# EAGLE design arcade-X (EAGLE 7.6.0)
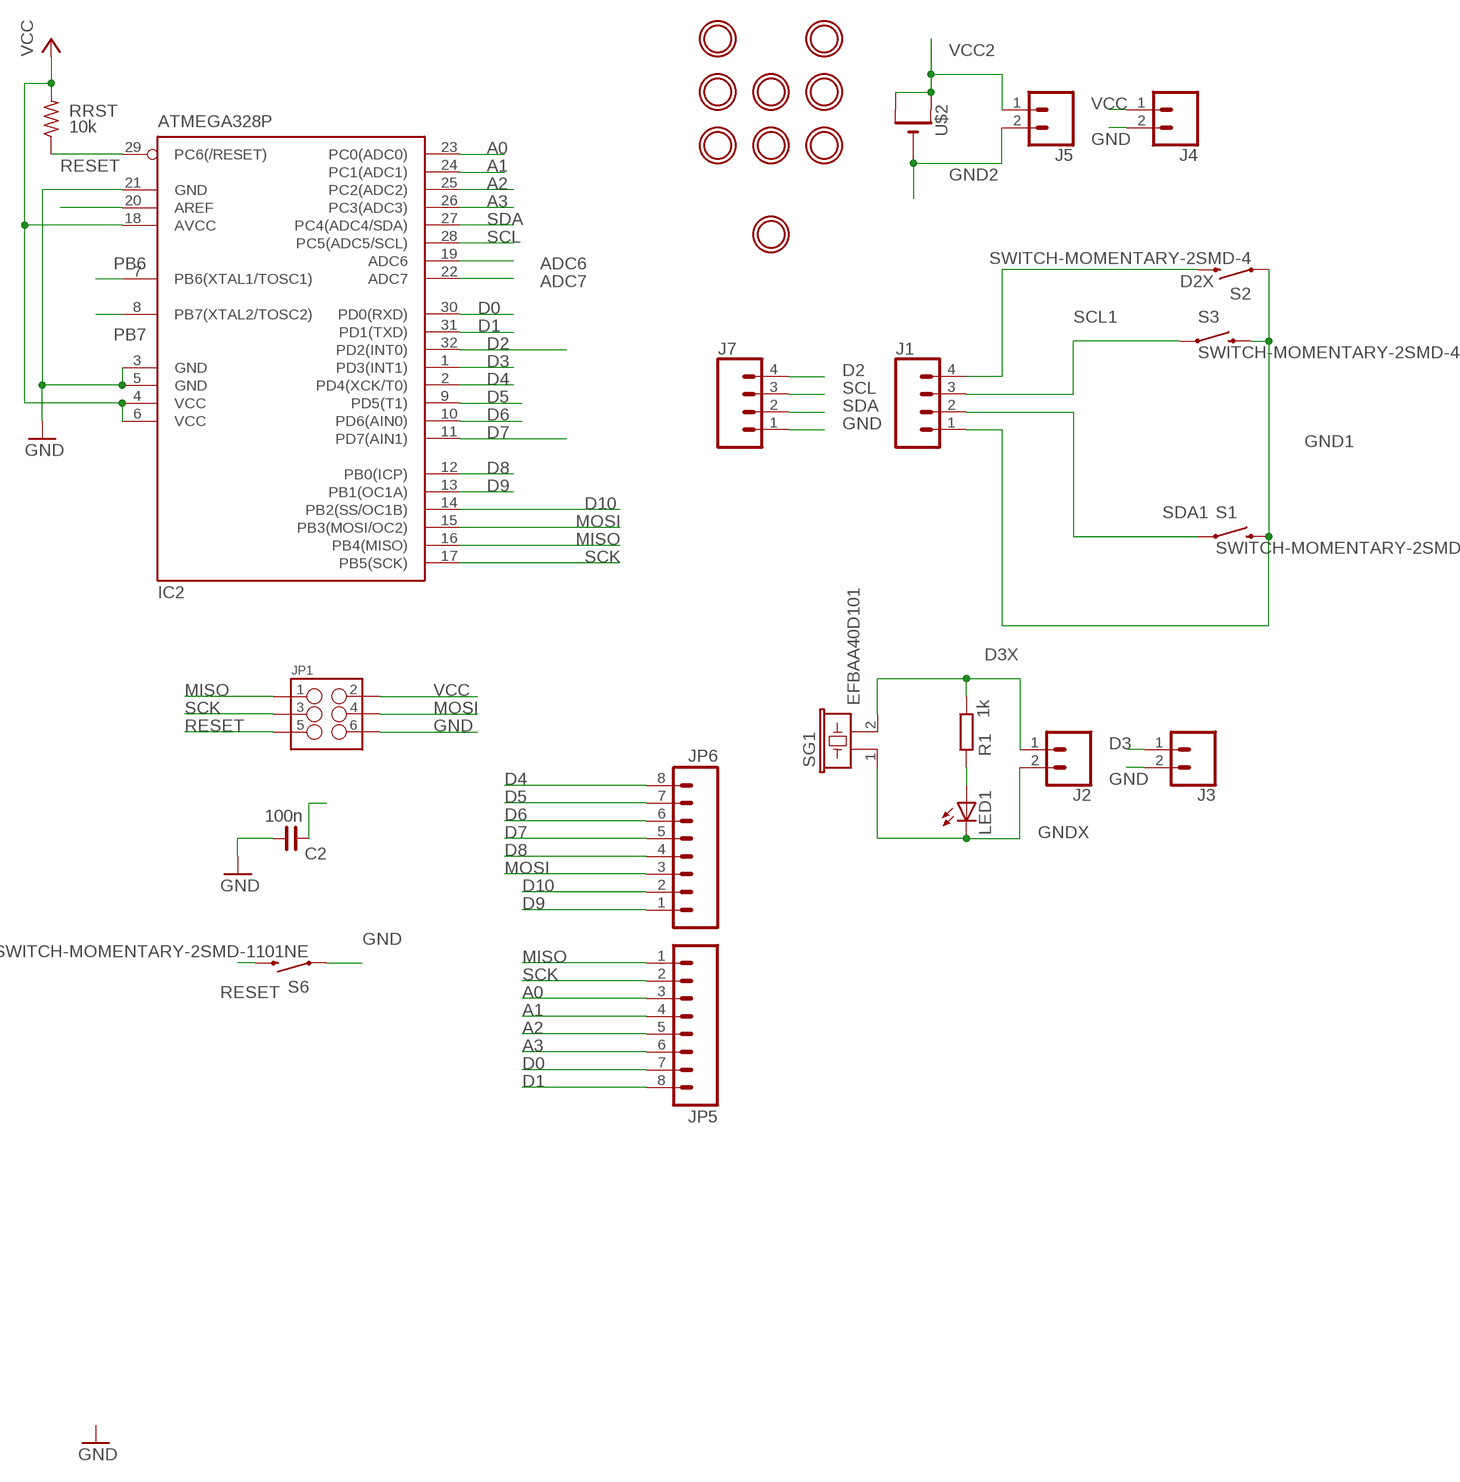
[diagram p0: schematic, sheet 1]

## Parts
C2  100n  C_0805  [C0805]
IC2  ATMEGA328P  MEGA8-AI  [TQFP32-08]
J1  CONN_04LONGPADS  [1X04_LONGPADS]
J2  CONN_02PTH3  [1X02_LONGPADS]
J3  CONN_02PTH3  [1X02_LONGPADS]
J4  CONN_02PTH3  [1X02_LONGPADS]
J5  CONN_02PTH3  [1X02_LONGPADS]
J7  CONN_04LONGPADS  [1X04_LONGPADS]
JP1  M03X2NO_SILK  [2X3-NS]
JP5  M08NO_SILK  [1X08_PIN1_NO_SILK]
JP6  M08NO_SILK  [1X08_PIN1_NO_SILK]
LED1  LED3MM  [LED3MM]
R1  1k  R-EU_R0805  [R0805]
RRST  10k  R-US_R0805  [R0805@1]
S1  SWITCH-MOMENTARY-2SMD-4  [TACTILE_SWITCH_TALL]
S2  SWITCH-MOMENTARY-2SMD-4  [TACTILE_SWITCH_TALL]
S3  SWITCH-MOMENTARY-2SMD-4  [TACTILE_SWITCH_TALL]
S6  SWITCH-MOMENTARY-2SMD-1101NE  [TACTILE-SWITCH-1101NE]
SG1  EFBAA40D101  [EFBAA40D101]
U$1  MOUNTINGHOLE3.0THIN  [MOUNTINGHOLE_3.0_PLATEDTHIN]
U$2  CR2032THM  [CR2032-THRU]
U$3  MOUNTINGHOLE2.0  [MOUNTINGHOLE_2.0_PLATED]
U$4  MOUNTINGHOLE2.0  [MOUNTINGHOLE_2.0_PLATED]
U$5  MOUNTINGHOLE2.0  [MOUNTINGHOLE_2.0_PLATED]
U$7  MOUNTINGHOLE2.0  [MOUNTINGHOLE_2.0_PLATED]
U$8  MOUNTINGHOLE2.0  [MOUNTINGHOLE_2.0_PLATED]
U$9  MOUNTINGHOLE2.0  [MOUNTINGHOLE_2.0_PLATED]
U$10  MOUNTINGHOLE2.0  [MOUNTINGHOLE_2.0_PLATED]
U$11  MOUNTINGHOLE2.0  [MOUNTINGHOLE_2.0_PLATED]

## Nets
A0: IC2.23(PC0(ADC0)) JP5.3
A1: IC2.24(PC1(ADC1)) JP5.4
A2: IC2.25(PC2(ADC2)) JP5.5
A3: IC2.26(PC3(ADC3)) JP5.6
ADC6: IC2.19(ADC6)
ADC7: IC2.22(ADC7)
AREF: IC2.20(AREF)
D0: IC2.30(PD0(RXD)) JP5.7
D1: IC2.31(PD1(TXD)) JP5.8
D2: IC2.32(PD2(INT0)) J7.4
D2X: J1.4 S2.B2
D3: IC2.1(PD3(INT1)) J3.1
D3X: J2.1 R1.1 SG1.2
D4: IC2.2(PD4(XCK/T0)) JP6.8
D5: IC2.9(PD5(T1)) JP6.7
D6: IC2.10(PD6(AIN0)) JP6.6
D7: IC2.11(PD7(AIN1)) JP6.5
D8: IC2.12(PB0(ICP)) JP6.4
D9: IC2.13(PB1(OC1A)) JP6.1
D10: IC2.14(PB2(SS/OC1B)) JP6.2
GND [gnd]: C2.1 IC2.3(GND) IC2.5(GND) IC2.21(GND) J3.2 J4.2 J7.1 JP1.6 S6.1
GND1 [gnd]: J1.1 S1.B2 S2.A2 S3.B2
GND2 [gnd]: J5.2 U$2.-
GNDX [gnd]: J2.2 LED1.K(C) SG1.1
MISO: IC2.16(PB4(MISO)) JP1.1 JP5.1
MOSI: IC2.15(PB3(MOSI/OC2)) JP1.4 JP6.3
N$1: LED1.A R1.2
PB6: IC2.7(PB6(XTAL1/TOSC1))
PB7: IC2.8(PB7(XTAL2/TOSC2))
RESET: IC2.29(PC6(/RESET)) JP1.5 RRST.1 S6.2
SCK: IC2.17(PB5(SCK)) JP1.3 JP5.2
SCL: IC2.28(PC5(ADC5/SCL)) J7.3
SCL1: J1.3 S3.A2
SDA: IC2.27(PC4(ADC4/SDA)) J7.2
SDA1: J1.2 S1.A2
VCC [vcc]: C2.2 IC2.4(VCC) IC2.6(VCC) IC2.18(AVCC) J4.1 JP1.2 RRST.2
VCC2 [vcc]: J5.1 U$2.+1(+) U$2.+2(+1)

## Library data of the parts
C2 = rc-master-smd:C_: NON-POLARIZED CAP
IC2 = atmel:MEGA8: MICROCONTROLLER 8 Kbytes FLASH, 1 kbytes SRAM, 512 bytes EEPROM, USART, 6-channel 10 bit ADC, 2-channel 8 bit ADC Pin compatible with Atmega48, ATMega88, ATMega168 Source: avr.lbr; MPN: ATMEGA8-16AU; OC_FARNELL: 9171371; OC_NEWARK: 73M8863
J1 J7 = SparkFun-Connectors:CONN_04: Multi connection point. Often used as Generic Header-pin footprint for 0.1 inch spaced/style header connections On any of the 0.1 inch spaced packages, you can populate with these: Break Away Headers - Straight <https://www.sparkfun.com/products/116> (PRT-00116) Break Away Male Headers - Right Angle <https://www.sparkfun.com/products/553> (PRT-00553) Female Headers <https://www.sparkfun.com/products/115> (PRT-00115) Break Away Headers - Machine Pin <https://www.sparkfun.com/products/117> (PRT-00117) Break Away Female Headers - Swiss Machine Pin <https://www.sparkfun.com/products/743> (PRT-00743) For SCREWTERMINALS and SPRING TERMINALS visit here: Screw Terimnals on SparkFun.com <https://www.sparkfun.com/search/results?term=Screw+Terminals> (5mm/3.5mm/2.54mm spacing) This device is also useful as a general connection point to wire up your design to another part of your project. Our various solder wires solder well into these plated through hole pads. Hook-Up Wire - Assortment (Stranded, 22 AWG) <https://www.sparkfun.com/products/11375> (PRT-11375) Hook-Up Wire - Assortment (Solid Core, 22 AWG) <https://www.sparkfun.com/products/11367> (PRT-11367) View the entire wire category on our website here <https://www.sparkfun.com/categories/141> Special notes: Molex polarized connector foot print use with SKU : PRT-08231 with associated crimp pins and housings. 1MM SMD Version SKU: PRT-10208; PROD_ID: CONN-09696
J2-J5 = SparkFun-Connectors:CONN_02: Multi connection point. Often used as Generic Header-pin footprint for 0.1 inch spaced/style header connections On any of the 0.1 inch spaced packages, you can populate with these: Break Away Headers - Straight <https://www.sparkfun.com/products/116> (PRT-00116) Break Away Male Headers - Right Angle <https://www.sparkfun.com/products/553> (PRT-00553) Female Headers <https://www.sparkfun.com/products/115> (PRT-00115) Break Away Headers - Machine Pin <https://www.sparkfun.com/products/117> (PRT-00117) Break Away Female Headers - Swiss Machine Pin <https://www.sparkfun.com/products/743> (PRT-00743) For SCREWTERMINALS and SPRING TERMINALS visit here: Screw Terimnals on SparkFun.com <https://www.sparkfun.com/search/results?term=Screw+Terminals> (5mm/3.5mm/2.54mm spacing) This device is also useful as a general connection point to wire up your design to another part of your project. Our various solder wires solder well into these plated through hole pads. Hook-Up Wire - Assortment (Stranded, 22 AWG) <https://www.sparkfun.com/products/11375> (PRT-11375) Hook-Up Wire - Assortment (Solid Core, 22 AWG) <https://www.sparkfun.com/products/11367> (PRT-11367) View the entire wire category on our website here <https://www.sparkfun.com/categories/141> Special notes: Molex polarized connector foot print use with: PRT-08233 with associated crimp pins and housings. 2.54_SCREWTERM for use with PRT-10571. 3.5mm Screw Terminal footprints for PRT-08084 5mm Screw Terminal footprints for use with PRT-08432
JP1 = SparkFun-Connectors:M03X2: 2x3 .1" header. Shrouded, with keying- CONN-10681 SMT- CONN-11415 Pogo pins- HW-11044
JP5 JP6 = SparkFun-Connectors:M08: Header 8 Standard 8-pin 0.1" header. Use with straight break away headers (SKU : PRT-00116), right angle break away headers (PRT-00553), swiss pins (PRT-00743), machine pins (PRT-00117), and female headers (PRT-00115).
LED1 = led:LED: LED OSRAM: - CHIPLED LG R971, LG N971, LY N971, LG Q971, LY Q971, LO R971, LY R971 LH N974, LH R974 LS Q976, LO Q976, LY Q976 LO Q996 - Hyper CHIPLED LW Q18S LB Q993, LB Q99A, LB R99A - SideLED LS A670, LO A670, LY A670, LG A670, LP A670 LB A673, LV A673, LT A673, LW A673 LH A674 LY A675 LS A676, LA A676, LO A676, LY A676, LW A676 LS A679, LY A679, LG A679 - Hyper Micro SIDELED® LS Y876, LA Y876, LO Y876, LY Y876 LT Y87S - SmartLED LW L88C, LW L88S LB L89C, LB L89S, LG L890 LS L89K, LO L89K, LY L89K LS L896, LA L896, LO L896, LY L896 - TOPLED LS T670, LO T670, LY T670, LG T670, LP T670 LSG T670, LSP T670, LSY T670, LOP T670, LYG T670 LG T671, LOG T671, LSG T671 LB T673, LV T673, LT T673, LW T673 LH T674 LS T676, LA T676, LO T676, LY T676, LB T676, LH T676, LSB T676, LW T676 LB T67C, LV T67C, LT T67C, LS T67K, LO T67K, LY T67K, LW E67C LS E67B, LA E67B, LO E67B, LY E67B, LB E67C, LV E67C, LT E67C LW T67C LS T679, LY T679, LG T679 LS T770, LO T770, LY T770, LG T770, LP T770 LB T773, LV T773, LT T773, LW T773 LH T774 LS E675, LA E675, LY E675, LS T675 LS T776, LA T776, LO T776, LY T776, LB T776 LHGB T686 LT T68C, LB T68C - Hyper Mini TOPLED® LB M676 - Mini TOPLED Santana® LG M470 LS M47K, LO M47K, LY M47K Source: http://www.osram.convergy.de LUXEON: - LUMILED® LXK2-PW12-R00, LXK2-PW12-S00, LXK2-PW14-U00, LXK2-PW14-V00 LXK2-PM12-R00, LXK2-PM12-S00, LXK2-PM14-U00 LXK2-PE12-Q00, LXK2-PE12-R00, LXK2-PE12-S00, LXK2-PE14-T00, LXK2-PE14-U00 LXK2-PB12-K00, LXK2-PB12-L00, LXK2-PB12-M00, LXK2-PB14-N00, LXK2-PB14-P00, LXK2-PB14-Q00 LXK2-PR12-L00, LXK2-PR12-M00, LXK2-PR14-Q00, LXK2-PR14-R00 LXK2-PD12-Q00, LXK2-PD12-R00, LXK2-PD12-S00 LXK2-PH12-R00, LXK2-PH12-S00 LXK2-PL12-P00, LXK2-PL12-Q00, LXK2-PL12-R00 Source: www.luxeon.com KINGBRIGHT: KA-3528ASYC Source: www.kingbright.com
R1 = rcl:R-EU_: RESISTOR, European symbol
RRST = rcl:R-US_: RESISTOR, American symbol
S1-S3 = SparkFun-Electromechanical:SWITCH-MOMENTARY-2: Various NO switches- pushbuttons, reed, etc; PROD_ID: SWCH-11966
S6 = SparkFun-Electromechanical:SWITCH-MOMENTARY-2: Various NO switches- pushbuttons, reed, etc; PROD_ID: SWCH-00815
SG1 = buzzer:EFB?: Piezoelectric Acoustic Transducer Source: Panbasonic .. 2SC1685.pdf; OC_FARNELL: unknown; OC_NEWARK: unknown
U$1 U$3-U$5 U$7-U$11 = microbuilder:MOUNTINGHOLE: Mounting Hole
U$2 = adafruit:CR2032

## Net classes
0 default: width 0.254 mm, drill 0.356 mm, clearance 0.254 mm
1 vcc: width 0.254 mm, drill 0.356 mm, clearance 0.254 mm
2 gnd: width 0.254 mm, drill 0.356 mm, clearance 0.254 mm

## Board
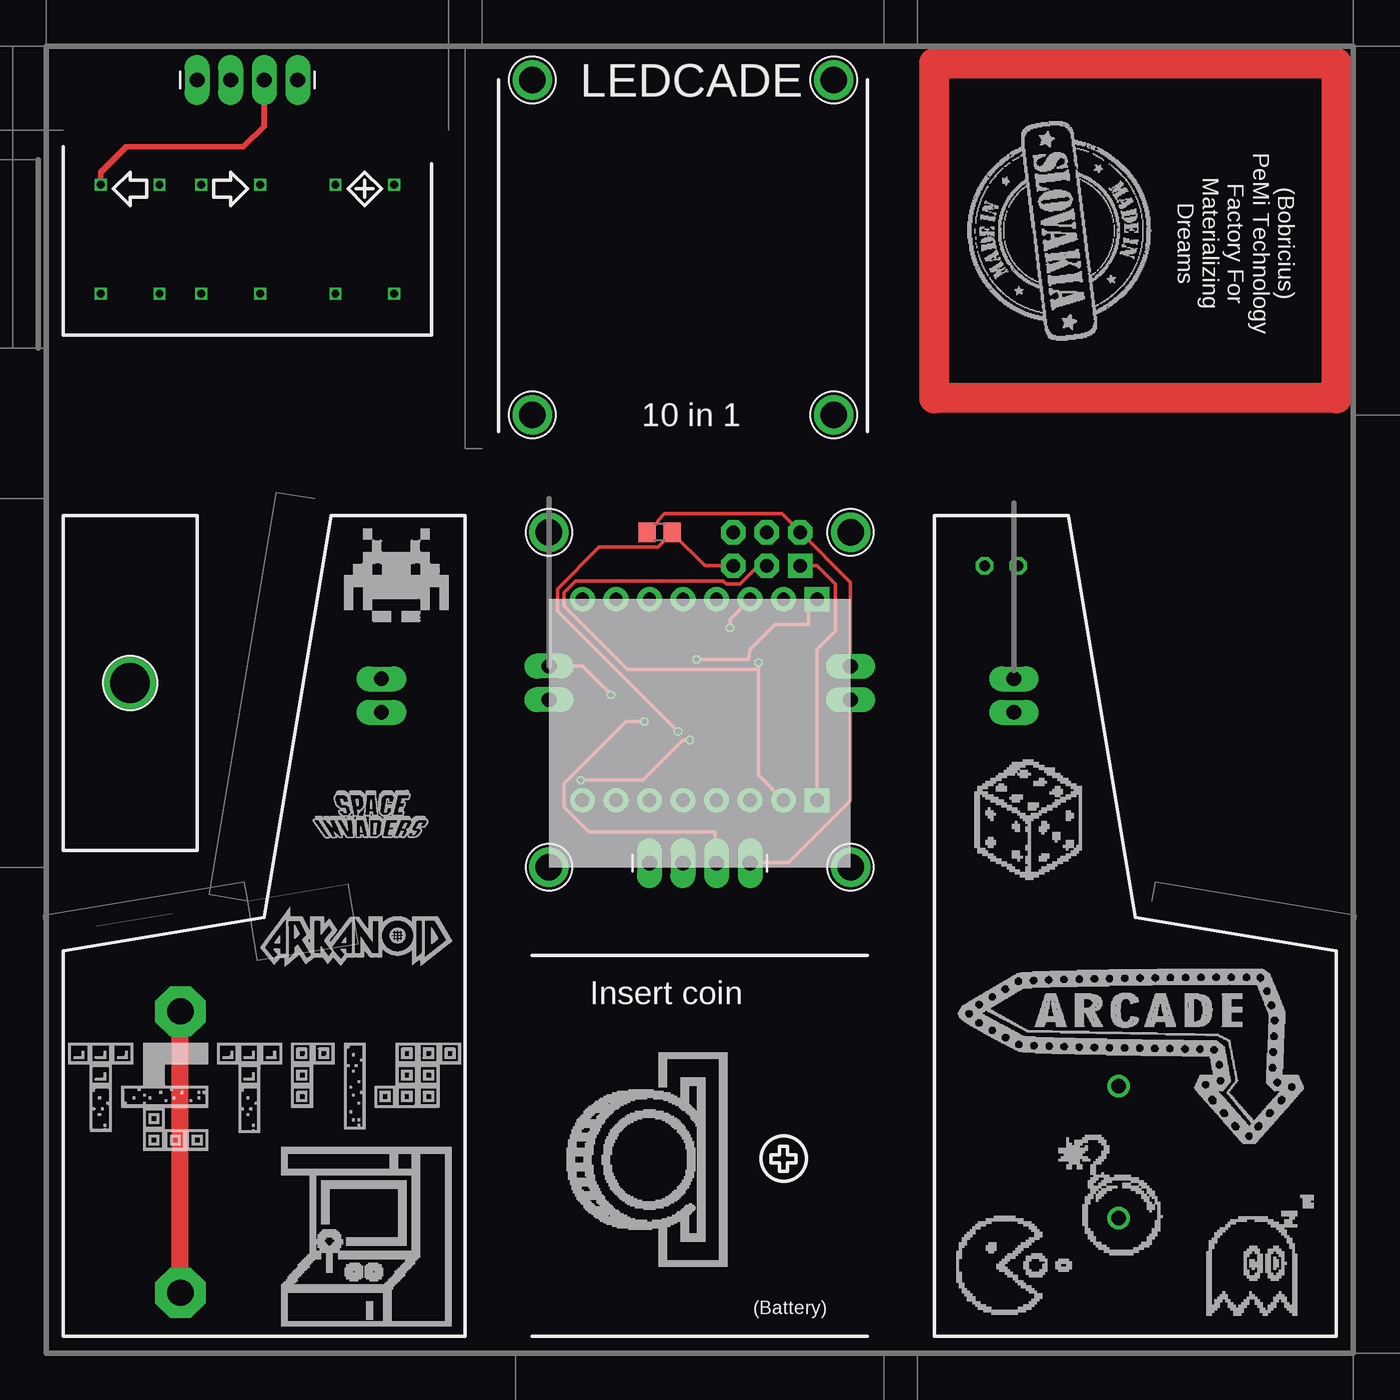
[diagram p1: board, top side]
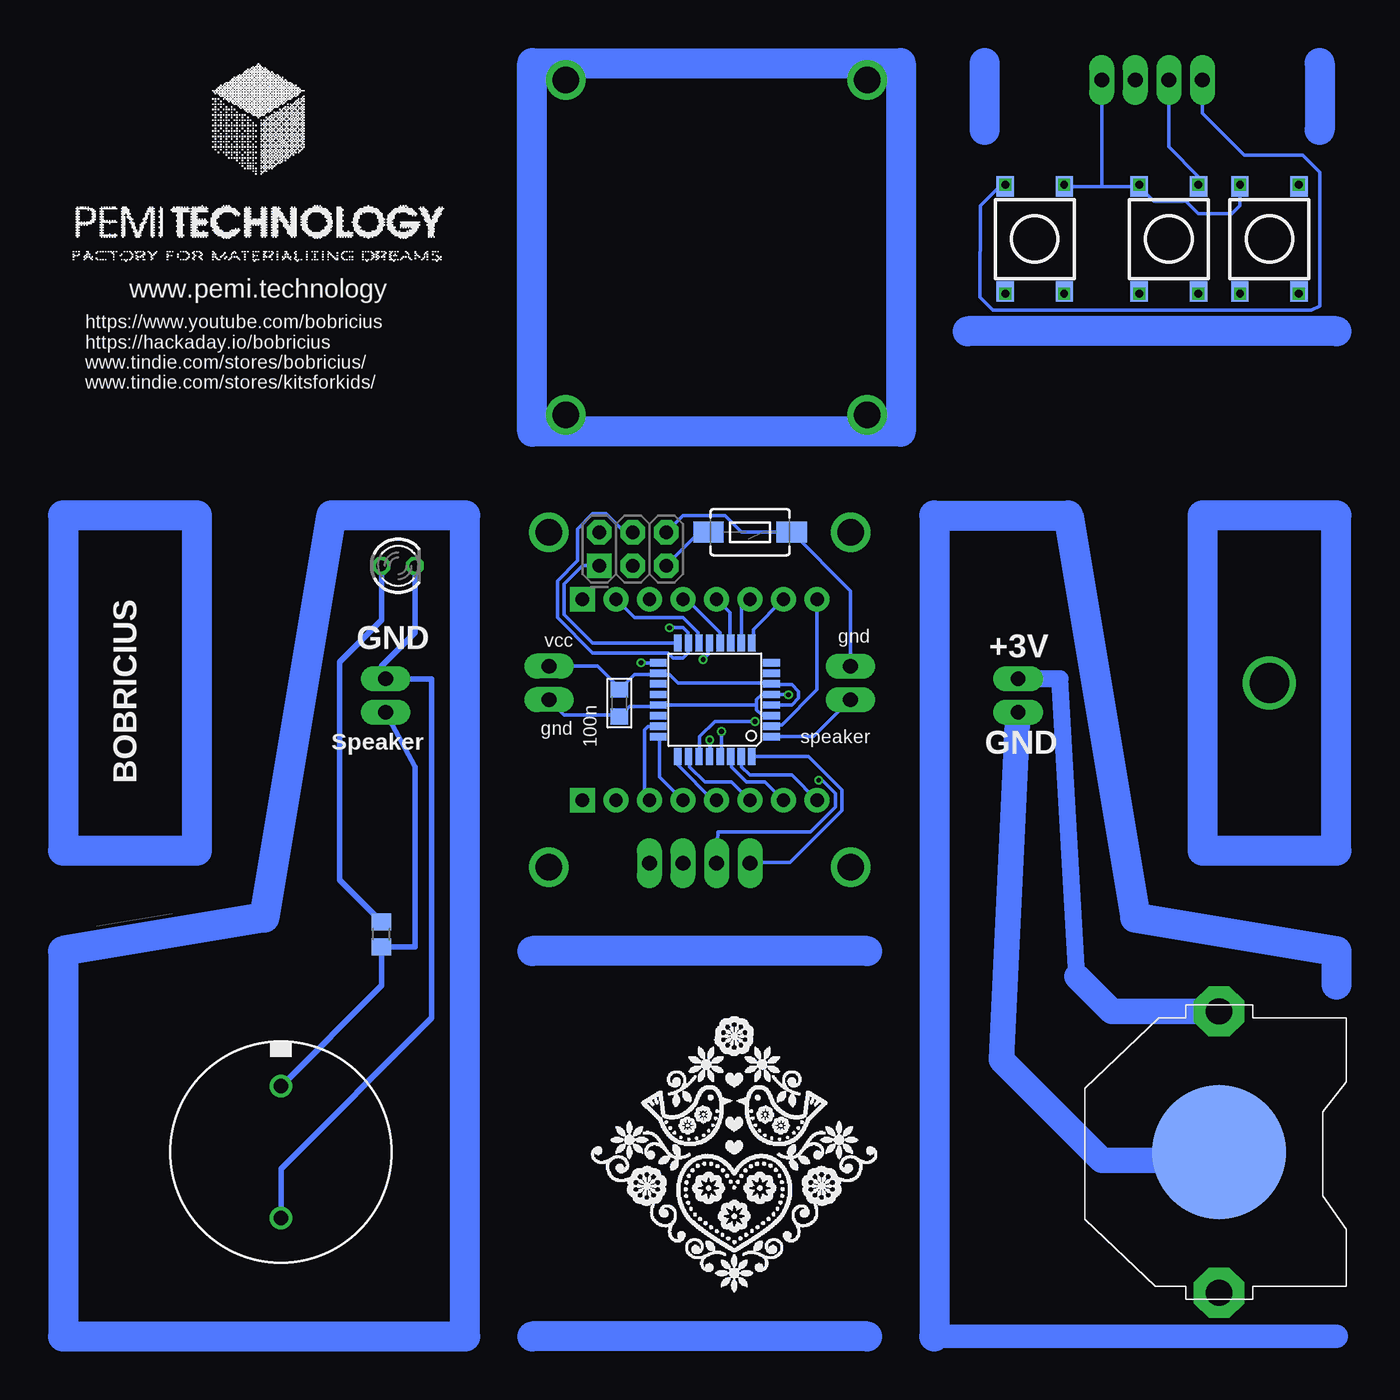
[diagram p2: board, bottom side, seen from below]

No outline drawn. Coordinates in mm, seen from the top.
Copper layers (1*16): Top 0.035mm / dielectric 1.5mm / Bottom 0.035mm
Design rules "ITEADstudio_DRC *": minimum track width 6mil, minimum drill 12mil, track to track 6mil, track to pad 6mil, pad to pad 6mil, via to via 6mil, smd to smd 0mil, copper to edge 20mil, drill to drill 10mil, minimum pad ring 10mil, minimum via ring 6mil, stop-mask expansion 2mil, vias tented up to drill 100mil, thermal gap 10mil

### Footprints (pad centres in the part's own frame; a part is rotated, then mirrored left to right if it is on the bottom)
C0805 = smd 1.2 x 1.3: 1 -1.016,0; 2 1.016,0
TQFP32-08 = smd 1.27 x 0.559: 1 -4.293,2.8; 2 -4.293,2; 3 -4.293,1.2; 4 -4.293,0.4; 5 -4.293,-0.4; 6 -4.293,-1.2; 7 -4.293,-2; 8 -4.293,-2.8; 17 4.293,-2.8; 18 4.293,-2; 19 4.293,-1.2; 20 4.293,-0.4; 21 4.293,0.4; 22 4.293,1.2; 23 4.293,2; 24 4.293,2.8 | smd 0.559 x 1.27: 9 -2.8,-4.293; 10 -2,-4.293; 11 -1.2,-4.293; 12 -0.4,-4.293; 13 0.4,-4.293; 14 1.2,-4.293; 15 2,-4.293; 16 2.8,-4.293; 25 2.8,4.293; 26 2,4.293; 27 1.2,4.293; 28 0.4,4.293; 29 -0.4,4.293; 30 -1.2,4.293; 31 -2,4.293; 32 -2.8,4.293
1X04_LONGPADS = drill 1.118 pad 1.88 long: 1 0,0; 2 2.54,0; 3 5.08,0; 4 7.62,0
1X02_LONGPADS = drill 1.118 pad 1.88 long: 1 0,0; 2 2.54,0
2X3-NS = drill 1.016 pad 1.88 square: 1 -2.54,-1.27 | drill 1.016 pad 1.88 octagon: 2 -2.54,1.27; 3 0,-1.27; 4 0,1.27; 5 2.54,-1.27; 6 2.54,1.27
1X08_PIN1_NO_SILK = drill 1.016 pad 1.88 square: 1 0,0 | drill 1.016 pad 1.88: 2 2.54,0; 3 5.08,0; 4 7.62,0; 5 10.16,0; 6 12.7,0; 7 15.24,0; 8 17.78,0
LED3MM = drill 0.813 octagon: A -1.27,0; K 1.27,0
R0805 = smd 1.3 x 1.5: 1 -0.95,0; 2 0.95,0
R0805@1 = smd 1.3 x 1.5: 1 -0.95,0; 2 0.95,0
TACTILE_SWITCH_TALL = smd 1.55 x 1.3: A1 -3.975,-2.25; A2 3.975,-2.25; B1 -3.975,2.25; B2 3.975,2.25
TACTILE-SWITCH-1101NE = smd 2.3 x 1.6: 1 -3.15,0; 2 3.15,0
EFBAA40D101 = drill 1.1 pad 1.676: 1 -5,0; 2 5,0
MOUNTINGHOLE_3.0_PLATEDTHIN = drill 3 pad 3.6: P$1 0,0
CR2032-THRU = drill 2 pad 3.81 octagon: +1 -10.668,0; +2 10.668,0 | smd 10.16 x 10.16: - 0,0
MOUNTINGHOLE_2.0_PLATED = drill 2 pad 3: P$1 0,0

### Placement (x,y rotation side)
C2  172.47,155.96 90 bottom
IC2  165.23,156.21 180 bottom
J1  135.89,203.2 180 top
J2  190.18,155.26 90 bottom
J3  154.94,156.21 90 top
J4  177.8,158.75 270 top
J5  142.24,157.8 270 top
J7  170.18,143.83 180 top
JP1  171.45,167.64 0 bottom
JP5  175.26,148.59 180 top
JP6  175.26,163.83 180 top
LED1  189.23,166.37 0 bottom
R1  190.5,138.43 90 bottom
RRST  163.32,168.91 180 top
S1  123.19,191.13 90 bottom
S2  140.97,191.13 90 bottom
S3  130.81,191.13 90 bottom
S6  162.56,168.91 180 bottom
SG1  198.12,121.92 90 bottom
U$1  123.19,157.48 0 top
U$2  127,121.92 270 bottom
U$3  153.67,203.2 0 top
U$4  176.53,177.8 0 top
U$5  153.67,177.8 0 top
U$7  176.53,203.2 0 top
U$8  154.94,143.51 0 top
U$9  177.8,143.51 0 top
U$10  154.94,168.91 0 top
U$11  177.8,168.91 0 top

### Tracks (layer width: path | path; a pad name or v marks a point on that pad's centre or on a via)
A0
  Bottom 0.254: JP5.3 170.56,148.97 170.56,153.92 170.31,154.18 169.54,154.18 IC2.23
A1
  Bottom 0.254: JP5.4 169.42,150.37 169.42,153.29 IC2.24
A2
  Bottom 0.254: JP5.5 165.35,148.59 168.02,151.26 168.02,151.89 IC2.25
A3
  Bottom 0.254: JP5.6 163.96,149.99 165.99,149.99 167.13,151.13 167.13,151.89 IC2.26
D0
  Bottom 0.254: JP5.7 161.42,149.99 162.81,149.99 163.96,151.13 163.96,151.89 IC2.30
D1
  Bottom 0.254: JP5.8 159.38,150.5 162.56,150.5 163.19,151.13 163.19,151.89 IC2.31
D2
  Bottom 0.254: IC2.32 162.31,151.89 158.12,151.89 155.57,149.35 155.57,147.83 159.51,143.89 162.56,143.89 J7.4
D2X
  Bottom 0.254: S2.B2 143.66,195.11 145.1,193.68 145.12,186.72 144.15,185.74 120.02,185.74 119.38,186.06 119.38,196.22 120.65,197.49 125.09,197.49 128.27,200.66 J1.4
D3
  Bottom 0.254: J3.1 157.73,153.42 160.91,153.42 IC2.1
D3X
  Bottom 0.406: J2.1 187.96,151.13 187.96,137.48 R1.1 190.5,134.54 SG1.2
D4
  Bottom 0.254: JP6.8 157.48,156.97 160.15,154.31 160.91,154.31 IC2.2
D5
  Bottom 0.254: JP6.7 162.31,161.54 162.31,160.53 IC2.9
D6
  Bottom 0.254: JP6.6 163.19,163.19 163.19,160.53 IC2.10
D7
  Bottom 0.254: JP6.5 164.08,162.81 164.08,160.53 IC2.11
D8
  Bottom 0.254: JP6.4 167.39,163.83 164.85,161.29 164.85,160.53 IC2.12
D9  (via drill 0.36)
  Top 0.254: v166.12,159.26 170.05,159.26 170.18,160.02 172.09,161.93 174.62,161.93 174.62,163.83 JP6.1
  Bottom 0.254: v166.12,159.26 165.74,159.64 165.74,160.4 IC2.13
D10
  Bottom 0.254: JP6.2 171.32,162.43 167.64,162.43 166.5,161.29 166.5,160.53 IC2.14
GND  (via drill 0.36)
  Top 0.254: J4.2 177.8,148.59 173.1,143.89 170.18,143.89 J7.1 | J3.2 157.48,158.75 v159.64,156.59
  Bottom 0.254: JP1.6 167.64,170.18 164.47,170.18 163.19,168.91 S6.1 159.38,168.91 154.94,164.47 J3.2 | 162.05,155.83 162.05,156.21 161.67,156.59 161.04,156.59 IC2.5 160.91,156.59 v159.64,156.59 | 162.05,155.83 162.05,155.45 161.67,155.07 161.04,155.07 IC2.3 | 162.05,155.83 169.42,155.83 IC2.21 169.54,155.7 171.7,155.7 C2.1 172.47,155.07 176.66,155.07 J4.2
GND1
  Bottom 0.254: S1.B2 125.44,193.65 126.05,193.04 128.59,193.04 129.54,193.99 131.94,193.99 S3.B2 135.89,195.11 | 135.89,195.11 S2.A2 | J1.1 135.89,195.11
GND2
  Bottom 1.93: J5.2 143.51,128.91 135.89,121.28 127.64,121.28 U$2.-
GNDX
  Bottom 0.406: LED1.K 187.96,161.29 190.5,158.75 J2.2 186.69,157.8 186.69,132.08 198.12,120.65 SG1.1
MISO
  Top 0.254: JP5.1 175.26,160.02 176.66,161.42 176.66,164.97 175.26,166.37 JP1.1
  Bottom 0.254: JP1.1 175.26,166.37 176.66,164.97 176.66,162.69 174.5,160.53 168.15,160.53 IC2.16
MOSI  (via drill 0.36)
  Top 0.254: v168.66,161.67 168.66,162.31 JP6.3
  Bottom 0.254: v168.66,161.67 167.64,161.67 167.26,161.29 167.26,160.53 IC2.15 167.26,160.4 167.26,159.77 167.64,159.38 168.4,159.38 168.78,159.77 174.5,159.77 177.16,162.43 177.16,165.23 175.64,166.75 175.64,169.16 174.5,170.31 173.48,170.31 172.09,168.91 JP1.4
N$1
  Bottom 0.406: LED1.A 190.5,162.24 193.68,159.07 193.68,142.56 R1.2
N$2
  Bottom 1.778: 148.59,107.95 118.11,107.95
  Bottom 2.286: 148.59,107.95 148.59,170.18 138.43,170.18 133.35,139.7 118.11,137.16 118.11,134.62
N$3
  Bottom 2.286: 184.15,170.18 194.31,170.18 199.39,139.7 214.63,137.16 214.63,107.95 184.15,107.95 184.15,170.18
N$4
  Bottom 2.286: 153.67,137.16 179.07,137.16
N$5
  Bottom 2.286: 153.67,107.95 179.07,107.95
N$6
  Top 2.286: 184.15,204.47 214.63,204.47 214.63,179.07 184.15,179.07 184.15,204.47
N$7
  Bottom 2.286: 151.13,176.53 179.07,176.53 179.07,204.47 151.13,204.47 151.13,176.53
N$8
  Bottom 2.286: 118.11,184.15 146.05,184.15
N$9
  Bottom 2.286: 144.78,204.47 144.78,199.39
N$10
  Bottom 2.286: 119.38,204.47 119.38,199.39
N$11
  Bottom 2.286: 118.11,170.18 128.27,170.18 128.27,144.78 118.11,144.78 118.11,170.18
N$12
  Bottom 2.286: 204.47,170.18 214.63,170.18 214.63,144.78 204.47,144.78 204.47,170.18
N$13  (via drill 0.6)
  other vias: 125.41,195.26
N$14  (via drill 0.6)
  other vias: 128.59,195.26
N$15  (via drill 0.6)
  other vias: 133.03,195.26
N$16  (via drill 0.6)
  other vias: 138.75,195.26
N$17  (via drill 0.6)
  other vias: 143.19,195.26
N$18  (via drill 0.6)
  other vias: 143.19,187.01
N$19  (via drill 0.6)
  other vias: 133.03,187.01
N$20  (via drill 0.6)
  other vias: 125.41,187.01
N$21  (via drill 0.6)
  other vias: 120.97,187.01
N$22  (via drill 0.6)
  other vias: 138.75,187.01
N$23  (via drill 0.6)
  other vias: 128.59,187.01
RESET  (via drill 0.36)
  Top 0.254: v164.72,153.8 155.57,162.94 155.57,164.59 158.75,167.77 163.19,167.77 164.34,168.91 RRST.1 164.34,168.78 166.75,166.37 JP1.5
  Bottom 0.254: S6.2 166.37,168.91 JP1.5 | v164.72,153.8 164.72,152.02 IC2.29
SCK  (via drill 0.36)
  Top 0.254: 170.81,158.5 170.81,150.5 JP5.2 | 170.81,158.5 v170.81,159 | JP1.3 170.81,166.37 169.42,164.97 168.4,164.97 168.15,165.23 156.97,165.23 156.08,164.34 156.08,163.32 160.91,158.5 170.81,158.5
  Bottom 0.254: v170.81,159 169.54,159 IC2.17
SCL  (via drill 0.36)
  Top 0.254: v165.61,153.16 165.1,153.16 162.05,150.11 v157.35,150.11
  Bottom 0.254: v165.61,153.16 165.61,152.02 IC2.28 | v157.35,150.11 157.1,150.11 156.08,149.1 156.08,148.08 157.99,146.18 164.97,146.18 165.1,144.15 J7.3
SCL1
  Bottom 0.254: S3.A2 128.56,195.87 130.81,198.12 J1.3
SDA  (via drill 0.36)
  Top 0.254: v162.18,154.56 160.78,154.56 156.08,149.86 156.08,148.08 157.99,146.18 167.51,146.18 167.64,144.15 J7.2
  Bottom 0.254: v162.18,154.56 165.23,154.56 166.37,153.42 166.37,152.02 IC2.27
SDA1  (via drill 0.6)
  Top 0.406: v120.97,195.26 120.97,196.22 122.87,198.12 131.76,198.12 133.35,199.71 J1.2
  Bottom 0.406: S1.A2 120.97,195.14 v120.97,195.26
VCC
  Top 0.254: RRST.2 162.43,168.91 163.19,169.67 163.19,169.8 163.7,170.31 172.59,170.31 JP1.2 177.8,165.1 J4.1
  Bottom 0.254: IC2.4 160.91,155.83 159.38,155.83 158.88,156.34 158.88,156.84 159.38,157.35 160.91,157.35 IC2.6 161.04,157.48 168.02,157.48 168.66,158.12 169.42,158.12 IC2.18 169.54,158.12 171.32,158.12 C2.2 172.47,157.1 174.12,158.75 J4.1
VCC2
  Top 1.27: U$2.+2 U$2.+1
  Bottom 1.27: 137.79,135.25 139.06,157.8 J5.1
  Bottom 1.93: U$2.+1 135.13,132.59 137.79,135.25

### Text on the board
tNames: LEDCADE | (Bobricius) / PeMi Technology / Factory For / Materializing / Dreams | 10 in 1 | Insert coin | (Battery)
bNames: www.pemi.technology | https://www.youtube.com/bobricius / https://hackaday.io/bobricius / www.tindie.com/stores/bobricius/ / www.tindie.com/stores/kitsforkids/ | BOBRICIUS | gnd | vcc | GND | +3V | 100n | gnd | speaker | GND | Speaker